# EAGLE design tusb211 (EAGLE 8.3.2)
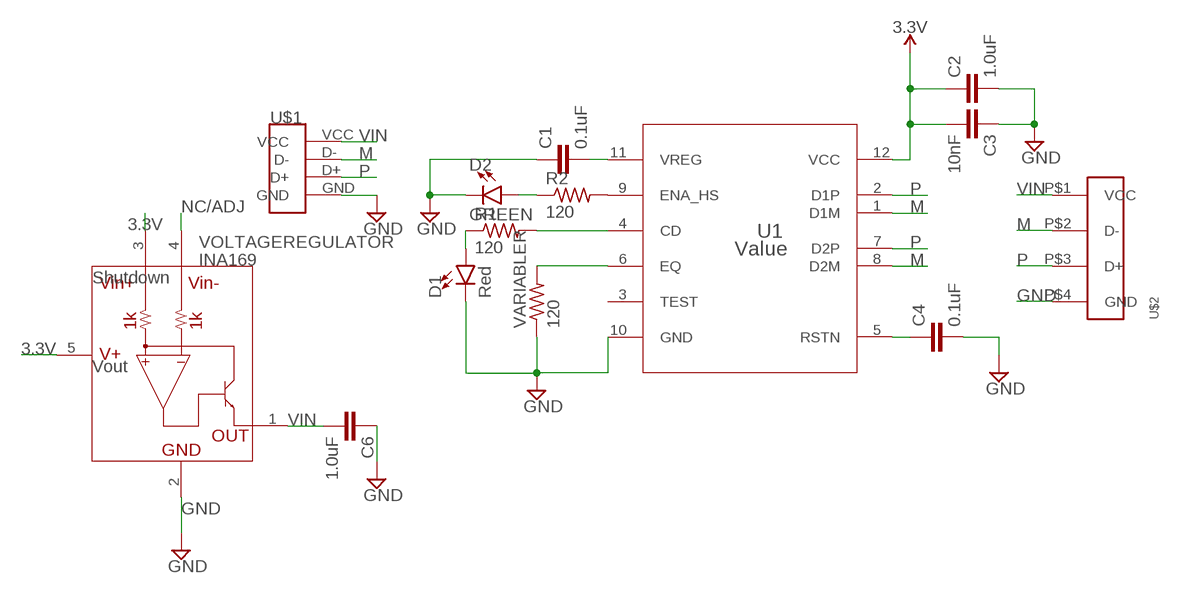
[diagram p0: schematic, sheet 1]

## Parts
C1  0.1uF  0.1UF-0603-25V-(+80/-20%)  [0603]
C2  1.0uF  1.0UF-0603-16V-10%  [0603]
C3  10nF  10NF-0603-50V-10%  [0603]
C4  0.1uF  0.1UF-0603-25V-(+80/-20%)  [0603]
C6  1.0uF  1.0UF-0603-16V-10%  [0603]
D1  Red  LED-RED0603-SMART  [LED-0603]
D2  GREEN  LED-GREEN0603  [LED-0603]
R1  120  R-US_R0805  [R0805]
R2  120  R-US_R0805  [R0805]
U1  Value  TUSB211RWBR  [RWB0012A]
U$1  TYPEAUSB  [TYPEAUSB]
U$2  USB  [USBSMD]
VARIABLER  120  R-US_R0805  [R0805]
VOLTAGEREGULATOR  INA169  [SOT23-5]

## Nets
3.3V: C2.1 C3.2 U1.12(VCC) VOLTAGEREGULATOR.3(VIN+) VOLTAGEREGULATOR.5(V+)
GND: C1.1 C2.2 C3.1 C4.2 C6.1 D1.C D2.C U1.10(GND) U$1.GND U$2.P$4(GND) VARIABLER.1 VOLTAGEREGULATOR.2(GND)
M: U1.1(D1M) U1.8(D2M) U$1.D- U$2.P$2(D-)
N$1: C1.2 U1.11(VREG)
N$2: D1.A R1.1
N$3: R1.2 U1.4(CD)
N$4: C4.1 U1.5(RSTN)
N$5: U1.6(EQ) VARIABLER.2
N$6: R2.2 U1.9(ENA_HS)
N$7: D2.A R2.1
NC/ADJ: VOLTAGEREGULATOR.4(VIN-)
P: U1.2(D1P) U1.7(D2P) U$1.D+ U$2.P$3(D+)
VIN: C6.2 U$1.VCC U$2.P$1(VCC) VOLTAGEREGULATOR.1(OUT)
Unconnected: U1.3(TEST)

## Notes on the sheet
- Shutdown
- Vout

## Library data of the parts
C1 C4 = SparkFun-Capacitors:0.1UF: 0.1µF ceramic capacitors A capacitor is a passive two-terminal electrical component used to store electrical energy temporarily in an electric field.; PROD_ID: CAP-00810
C2 C6 = SparkFun-Capacitors:1.0UF: 1µF ceramic capacitors A capacitor is a passive two-terminal electrical component used to store electrical energy temporarily in an electric field.; PROD_ID: CAP-00868
C3 = SparkFun-Capacitors:10NF: 0.01uF/10nF/10,000pF ceramic capacitors A capacitor is a passive two-terminal electrical component used to store electrical energy temporarily in an electric field. CAP-09321; PROD_ID: CAP-00867
D1 = SparkFun-LED:LED-RED: Red SMD LED Used in manufacturing of most products at SparkFun Packages: 0603 - SMD 0603 package [Product Link] <http://docs.avagotech.com/docs/AV02-0551EN> 0603 SMART - SMD 0603 SMART package ( more efficient and expensive)[Product Link] <http://www.osram-os.com/Graphics/XPic2/00077099_0.pdf> 1206 - SMD1206 package [Product Link] <https://www.sparkfun.com/datasheets/DevTools/LilyPad/Q150OVS4.pdff> SparkFun Products: Pro Mini 328 -5V <https://www.sparkfun.com/products/821> RedBoard <https://www.sparkfun.com/products/12757> IOIO-OTG <https://www.sparkfun.com/products/13613>; PROD_ID: DIO-11154
D2 = SparkFun-LED:LED-GREEN: Green SMD LED Used in manufacturing of various products at SparkFun Packages: 0603 - SMD 0603 package [Product Link] <http://www.futureelectronics.com/en/technologies/semiconductors/optoelectronics/leds/Pages/9894312-LTST-C190GKT.aspx?CrossPart=HSMG-C190&IM=0> LilyPad 1206 - SMD1206 LilyPad package [Product Link] <http://www.futureelectronics.com/en/Technologies/Product.aspx?ProductID=IN150NGHARVATEKCORPORATION2049943&IM=0> 1206 - SMD1206 package [Product Link] <http://www.futureelectronics.com/en/technologies/semiconductors/optoelectronics/leds/Pages/8315665-LTST-C150KGKT.aspx?IM=0> 1206 Bottom Mount -SMD 1206 Bottom Mount [Product Link] <http://www.digikey.com/product-detail/en/lite-on-inc/LTST-C230KGKT/160-1456-1-ND/386854> SparkFun Products: Pro Mini 328 -5V <https://www.sparkfun.com/products/821> RedBoard <https://www.sparkfun.com/products/12757> MP3 Trigger <https://www.sparkfun.com/products/13720> Makey Makey <https://www.sparkfun.com/products/11076>; PROD_ID: DIO-00821
R1 R2 VARIABLER = rcl:R-US_: RESISTOR, American symbol
U1 = TUSB211:TUSB211RWBR; COMPTYPE: IC; MANUFACTURER: Texas Instruments; MOUNTTYPE: SMT; PACKAGEREFERENCE: RWB0012A; PARTNUMBER: TUSB211QRWBR; PIN_COUNT: 12; REFDES: RefDes; ROHS: Y; TYPE: TYPE
U$1 = TYPEAUSBSMDMALE:TYPEAUSB
U$2 = USBSMD:USB
VOLTAGEREGULATOR = SparkFun-IC-Special-Function:INA169: Current Output Current Shunt Monitor 0.5%, SOT23-5 Datasheet <http://cdn.sparkfun.com/datasheets/Sensors/Current/ina169.pdf> SparkFun Products SparkFun Current Sensor Breakout - INA169 <https://www.sparkfun.com/products/12040> (SEN-12040); PROD_ID: IC-11776

## Board
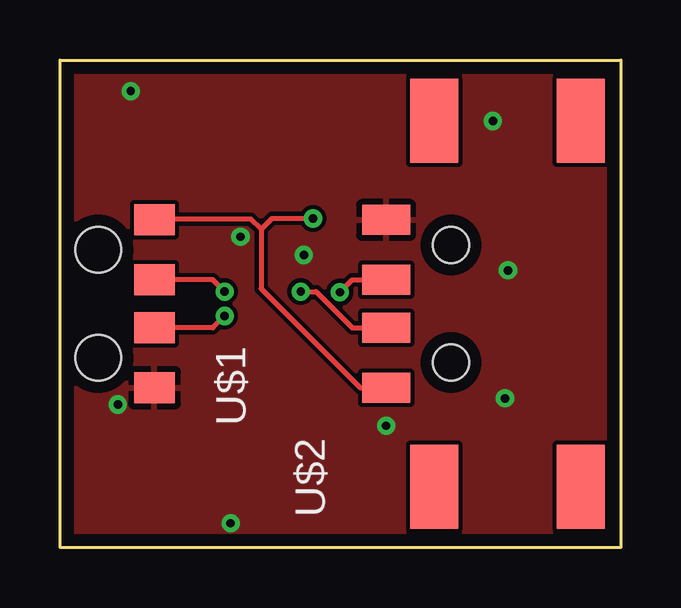
[diagram p1: board, top side]
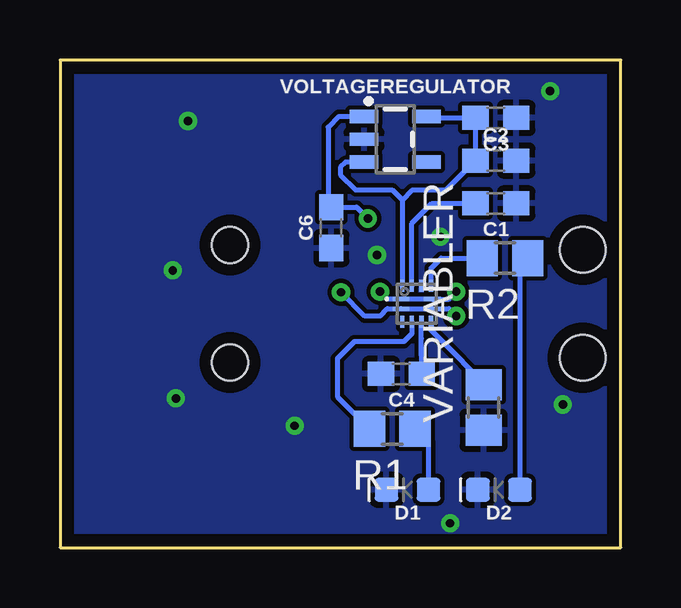
[diagram p2: board, bottom side, seen from below]

Size 23.37 x 20.32 mm. Coordinates in mm from the lower left corner, seen from the top.
Outline: 0,0 0,20.32 23.37,20.32 23.37,0 0,0
Copper layers (1*16): Top 0.035mm / dielectric 1.5mm / Bottom 0.035mm
Design rules "default *": minimum track width 6mil, minimum drill 0.35mm, track to track 7mil, track to pad 8mil, pad to pad 6mil, via to via 6mil, smd to smd 6mil, copper to edge 20mil, drill to drill 6mil, minimum pad ring 10mil, minimum via ring 8mil, stop-mask expansion 4mil, vias tented up to drill 0mil, thermal gap 10mil

### Footprints (pad centres in the part's own frame; a part is rotated, then mirrored left to right if it is on the bottom)
0603 = smd 1.1 x 1: 1 -0.85,0; 2 0.85,0
LED-0603 = smd 1 x 1: A -0.877,0; C 0.877,0
R0805 = smd 1.3 x 1.5: 1 -0.95,0; 2 0.95,0
RWB0012A = smd 0.7 x 0.175: 1 -0.65,0.2; 2 -0.65,-0.2; 7 0.65,-0.2; 8 0.65,0.2 | smd 0.175 x 0.5: 3 -0.6,-0.75; 4 -0.2,-0.75; 5 0.2,-0.75; 6 0.6,-0.75; 9 0.6,0.75; 10 0.2,0.75; 11 -0.2,0.75; 12 -0.6,0.75
TYPEAUSB = smd 1.3 x 1.7: D+ -1,0; D- 1,0; GND -3.5,0; VCC 3.5,0 | hole 1.9: 2.25,2.35; -2.25,2.35
USBSMD = smd 1.25 x 2: P$1 -3.5,0; P$2 -1,0; P$3 1,0; P$4 3.5,0 | smd 3.5 x 2: P$5 7.625,-2; P$6 7.625,-8.1; P$7 -7.625,-8.1; P$8 -7.625,-2 | hole 1.5: -2.45,-2.7; 2.45,-2.7
SOT23-5 = smd 0.55 x 1.2: 1 -0.95,-1.3; 2 0,-1.3; 3 0.95,-1.3; 4 0.95,1.3; 5 -0.95,1.3

### Placement (x,y rotation side)
C1  5.21,14.35 180 bottom
C2  5.21,16.13 0 bottom
C3  5.21,17.91 180 bottom
C4  9.14,7.24 180 bottom
C6  12.06,13.34 90 bottom
D1  8.89,2.41 180 bottom
D2  5.08,2.41 180 bottom
R1  9.53,4.95 180 bottom
R2  4.83,12.06 180 bottom
U1  8.51,10.16 0 bottom
U$1  3.94,10.16 90 top
U$2  13.59,10.16 90 top
VARIABLER  5.71,5.84 90 bottom
VOLTAGEREGULATOR  9.4,17.02 270 bottom

### Tracks (layer width: path | path; a pad name or v marks a point on that pad's centre or on a via)
3.3V
  Bottom 0.203: VOLTAGEREGULATOR.5 8.04,17.91 C3.2 C2.1 7.3,14.88 8.7,14.88 9.11,14.48 | 9.11,14.48 U1.12 | VOLTAGEREGULATOR.3 11.47,16.07 11.68,15.85 11.68,15.54 11.05,14.91 9.53,14.91 9.11,14.49 9.11,14.48
GND  (via drill 0.35)
  other vias: 2.41,5.97 13.59,5.08 10.16,12.19 2.95,19.02 7.52,12.95 18.67,11.56 18.54,6.22 18.03,17.78 7.11,1.02
  pour Top: 0.05,0 0.05,20.19 23.5,20.32 23.5,0
  pour Bottom: 0.05,20.37 0.05,0.05 23.5,0 23.5,20.32
M  (via drill 0.35)
  Top 0.203: v6.86,10.67 6.37,11.16 U$1.D- | v10.03,10.67 10.67,10.67 12.18,9.16 U$2.P$2
  Bottom 0.203: v6.86,10.67 7.17,10.36 U1.8 U1.1 9.72,10.36 v10.03,10.67
N$1
  Bottom 0.203: U1.11 8.71,13.52 7.87,14.35 C1.2
N$2
  Bottom 0.203: D1.A 8.01,4.39 R1.1
N$3
  Bottom 0.203: R1.2 11.81,6.29 11.81,7.87 11.1,8.59 9.04,8.59 8.71,8.92 U1.4
N$4
  Bottom 0.203: C4.1 8.31,8.71 U1.5
N$5
  Bottom 0.203: U1.6 7.91,9.05 7.49,8.64 5.71,6.86 VARIABLER.2
N$6
  Bottom 0.203: U1.9 7.91,11.65 7.49,12.06 R2.2
N$7
  Bottom 0.203: R2.1 4.2,11.74 D2.A
P  (via drill 0.35)
  Top 0.203: v6.86,9.65 6.37,9.16 U$1.D+ | v11.66,10.64 12.18,11.16 U$2.P$3
  Bottom 0.203: v6.86,9.65 7.17,9.96 U1.7 U1.2 9.72,9.96 10.03,9.65 10.67,9.65 v11.66,10.64
VIN  (via drill 0.35)
  Top 0.203: 8.38,13.26 8.38,10.79 12.52,6.66 U$2.P$1 | 8.38,13.26 7.95,13.69 3.97,13.69 arc90 U$1.VCC | 8.38,13.26 8.84,13.72 v10.54,13.72
  Bottom 0.203: VOLTAGEREGULATOR.1 11.75,17.97 12.19,17.53 12.19,14.31 C6.2 11.01,14.19 v10.54,13.72